# EAGLE schematic rxsms-2.0 (EAGLE 6.6.0)

## Sheet 1 of 8
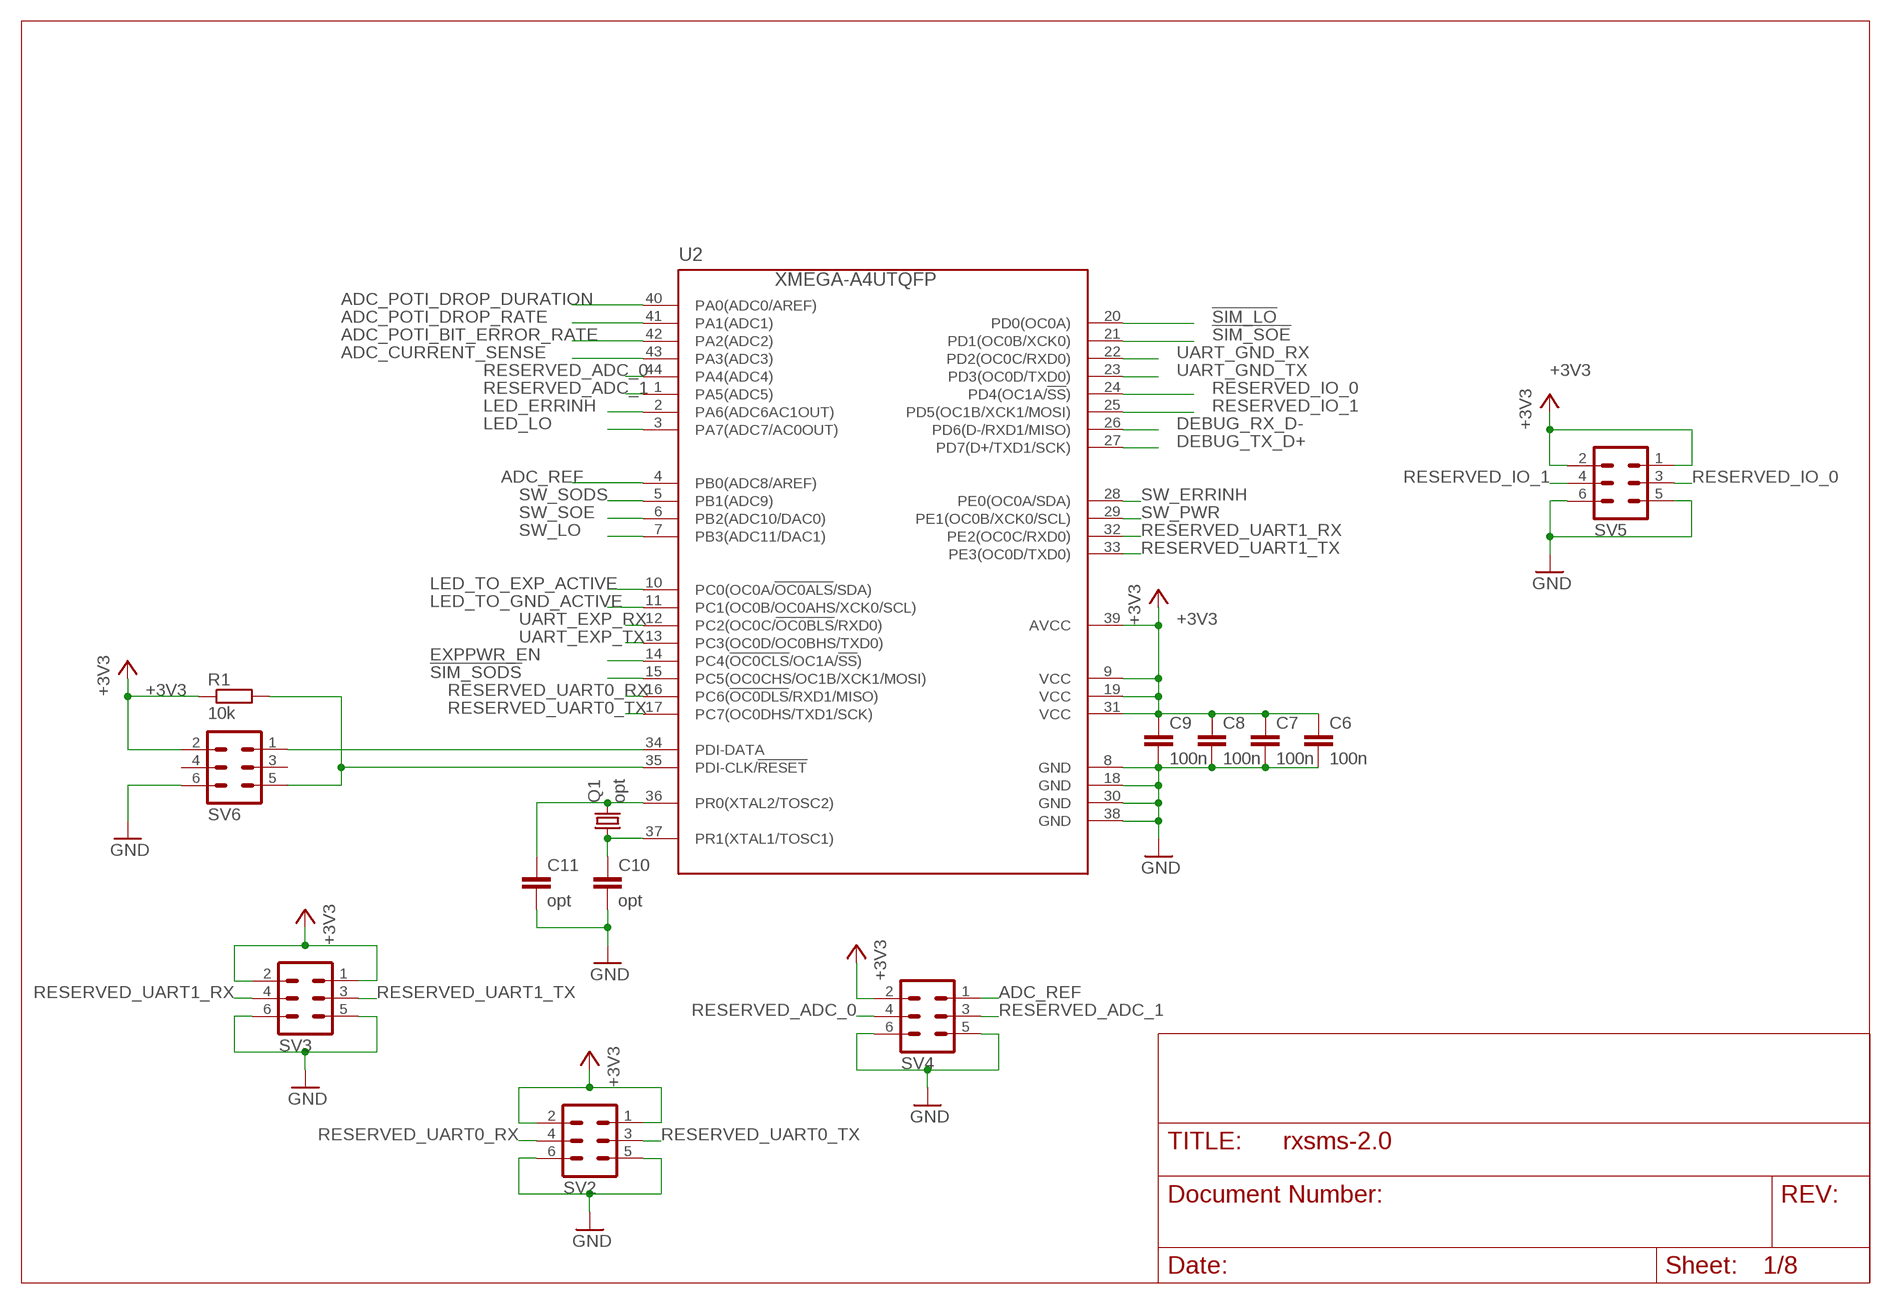
[diagram p0: schematic, sheet 1]

### Parts
C6  100n  C-EUC0805K  [C0805K]
C7  100n  C-EUC0805K  [C0805K]
C8  100n  C-EUC0805K  [C0805K]
C9  100n  C-EUC0805K  [C0805K]
C10  opt  C-EUC0805K  [C0805K]
C11  opt  C-EUC0805K  [C0805K]
Q1  opt  CRYSTALHC49S  [HC49/S]
R1  10k  R-EU_R0805  [R0805]
SV2  ML6  [ML6]
SV3  ML6  [ML6]
SV4  ML6  [ML6]
SV5  ML6  [ML6]
SV6  ML6  [ML6]
U2  XMEGA-A4UTQFP  [TQFP44]

### Nets
!SIM_LO: U2.20(PD0(OC0A)) ; also sheet 4,8
!SIM_SODS: U2.15(PC5(OC0CHS/OC1B/XCK1/MOSI)) ; also sheet 4,7
!SIM_SOE: U2.21(PD1(OC0B/XCK0)) ; also sheet 4,7
+3V3: C6.1 C7.1 C8.1 C9.1 R1.1 SV2.1 SV2.2 SV3.1 SV3.2 SV4.2 SV5.1 SV5.2 SV6.2 U2.9(VCC) U2.19(VCC) U2.31(VCC) U2.39(AVCC) ; also sheet 2,3,4,5,7
ADC_CURRENT_SENSE: U2.43(PA3(ADC3)) ; also sheet 4
ADC_POTI_BIT_ERROR_RATE: U2.42(PA2(ADC2)) ; also sheet 6
ADC_POTI_DROP_DURATION: U2.40(PA0(ADC0/AREF)) ; also sheet 6
ADC_POTI_DROP_RATE: U2.41(PA1(ADC1)) ; also sheet 6
ADC_REF: SV4.1 U2.4(PB0(ADC8/AREF)) ; also sheet 6
DEBUG_RX_D-: U2.26(PD6(D-/RXD1/MISO)) ; also sheet 2,5
DEBUG_TX_D+: U2.27(PD7(D+/TXD1/SCK)) ; also sheet 2,5
EXPPWR_EN: U2.14(PC4(!OC0CLS!/OC1A/!SS!)) ; also sheet 4,7
GND: C6.2 C7.2 C8.2 C9.2 C10.2 C11.2 SV2.5 SV2.6 SV3.5 SV3.6 SV4.5 SV4.6 SV5.5 SV5.6 SV6.6 U2.8(GND) U2.18(GND) U2.30(GND) U2.38(GND) ; also sheet 2,3,4,5,6,7,8
LED_ERRINH: U2.2(PA6(ADC6AC1OUT)) ; also sheet 7
LED_LO: U2.3(PA7(ADC7/AC0OUT)) ; also sheet 7
LED_TO_EXP_ACTIVE: U2.10(PC0(OC0A/!OC0ALS!/SDA)) ; also sheet 7
LED_TO_GND_ACTIVE: U2.11(PC1(OC0B/OC0AHS/XCK0/SCL)) ; also sheet 7
N$11: C10.1 Q1.1 U2.37(PR1(XTAL1/TOSC1))
N$12: C11.1 Q1.2 U2.36(PR0(XTAL2/TOSC2))
N$13: SV6.1 U2.34(PDI-DATA)
N$14: R1.2 SV6.5 U2.35(PDI-CLK/!RESET)
RESERVED_ADC_0: SV4.4 U2.44(PA4(ADC4))
RESERVED_ADC_1: SV4.3 U2.1(PA5(ADC5))
RESERVED_IO_0: SV5.3 U2.24(PD4(OC1A/!SS!))
RESERVED_IO_1: SV5.4 U2.25(PD5(OC1B/XCK1/MOSI))
RESERVED_UART0_RX: SV2.4 U2.16(PC6(!OC0DLS!/RXD1/MISO))
RESERVED_UART0_TX: SV2.3 U2.17(PC7(OC0DHS/TXD1/SCK))
RESERVED_UART1_RX: SV3.4 U2.32(PE2(OC0C/RXD0))
RESERVED_UART1_TX: SV3.3 U2.33(PE3(OC0D/TXD0))
SW_ERRINH: U2.28(PE0(OC0A/SDA)) ; also sheet 7
SW_LO: U2.7(PB3(ADC11/DAC1)) ; also sheet 7
SW_PWR: U2.29(PE1(OC0B/XCK0/SCL)) ; also sheet 7
SW_SODS: U2.5(PB1(ADC9)) ; also sheet 7
SW_SOE: U2.6(PB2(ADC10/DAC0)) ; also sheet 7
UART_EXP_RX: U2.12(PC2(OC0C/!OC0BLS!/RXD0)) ; also sheet 2,4
UART_EXP_TX: U2.13(PC3(OC0D/OC0BHS/TXD0)) ; also sheet 2,4
UART_GND_RX: U2.22(PD2(OC0C/RXD0)) ; also sheet 2
UART_GND_TX: U2.23(PD3(OC0D/TXD0)) ; also sheet 2
Unconnected: SV6.3 SV6.4

## Sheet 2 of 8
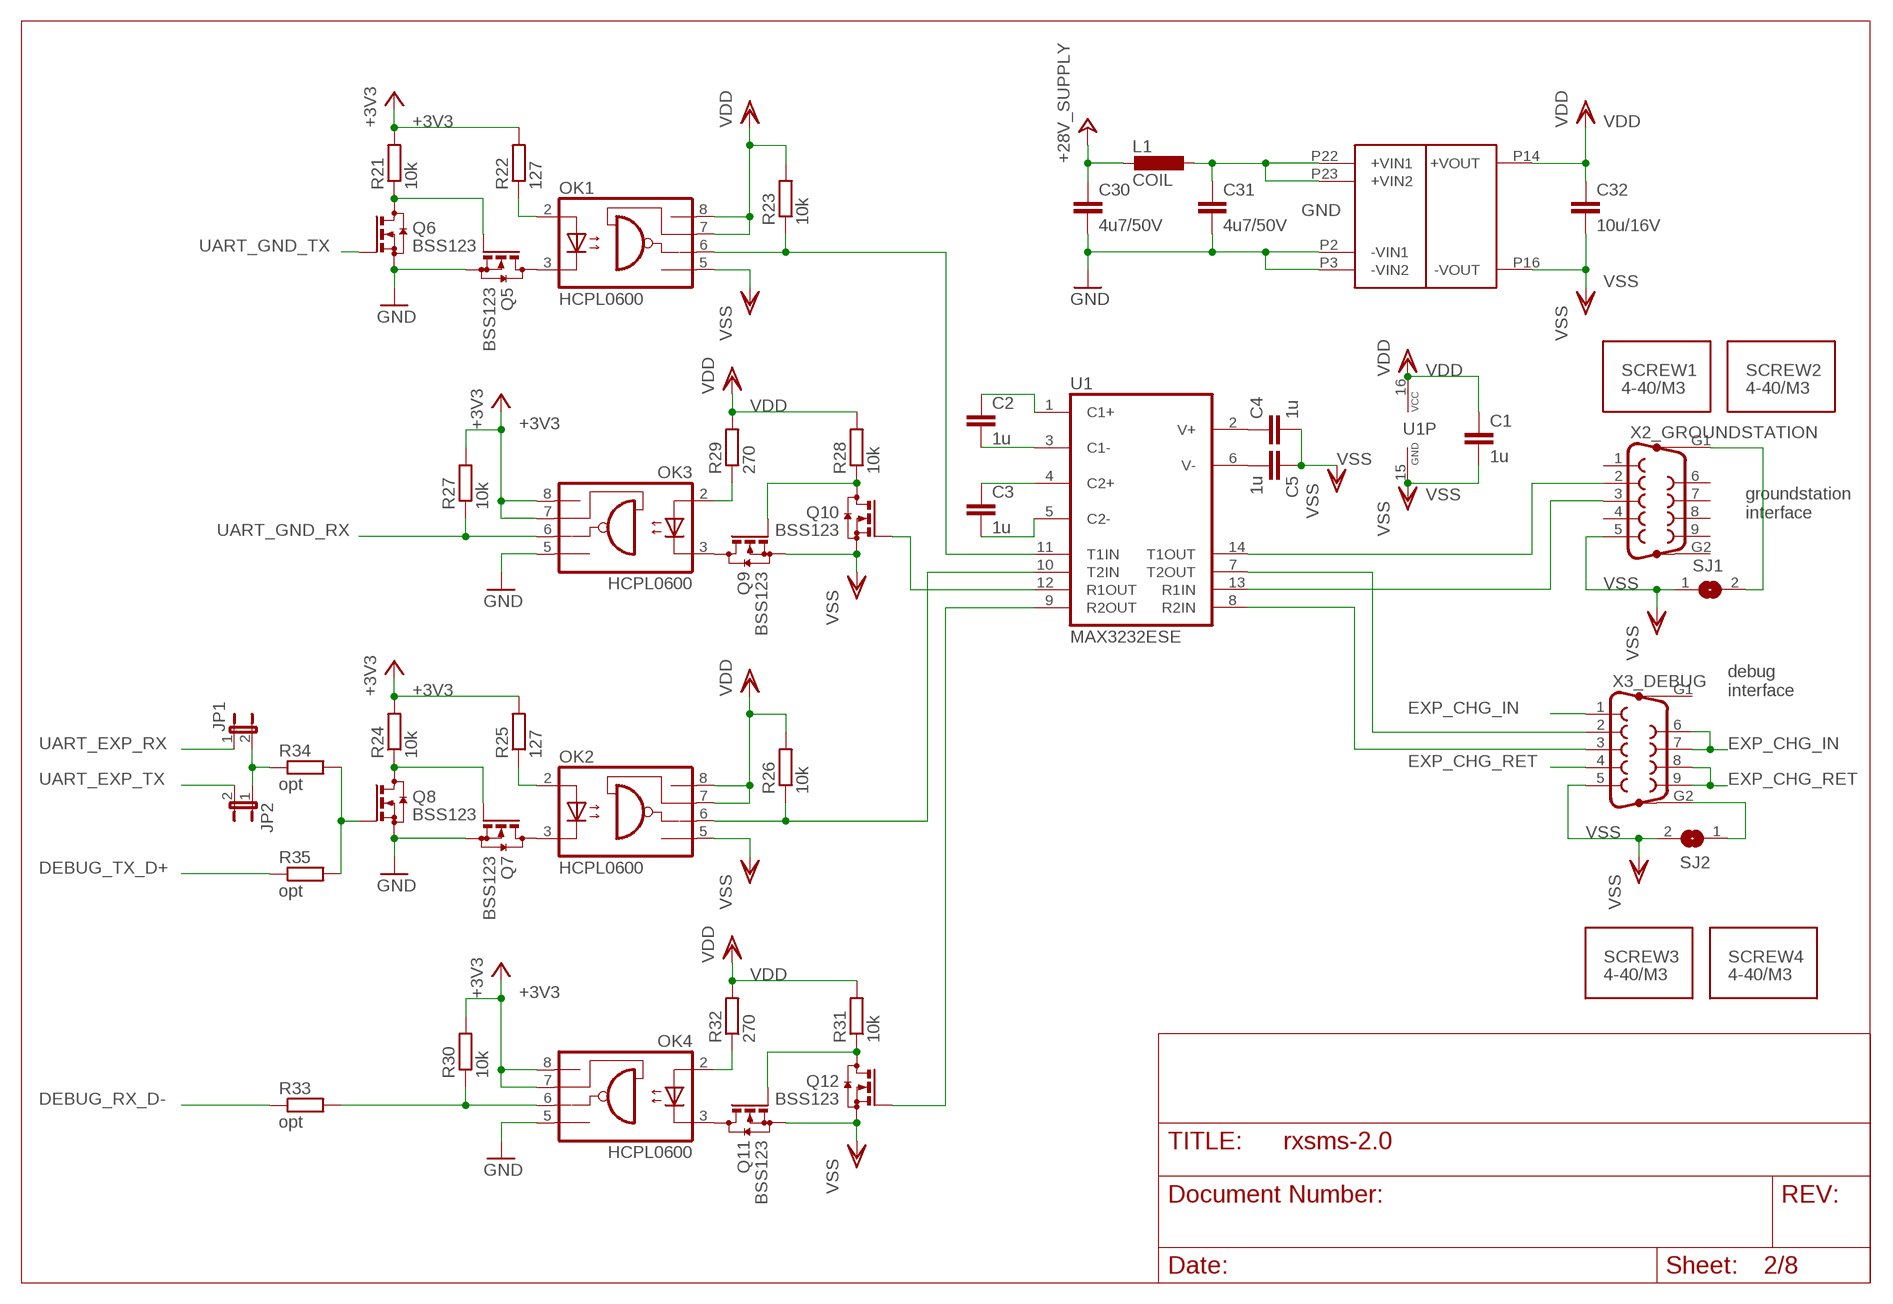
[diagram p1: schematic, sheet 2]

### Parts
C1  1u  C-EUC0805K  [C0805K]
C2  1u  C-EUC0805K  [C0805K]
C3  1u  C-EUC0805K  [C0805K]
C4  1u  C-EUC0805K  [C0805K]
C5  1u  C-EUC0805K  [C0805K]
C30  4u7/50V  C-EUC0805K  [C0805K]
C31  4u7/50V  C-EUC0805K  [C0805K]
C32  10u/16V  C-EUC0805K  [C0805K]
JP1  JP1E  [JP1]
JP2  JP1E  [JP1]
L1  COIL  [BOURNS-SRR0906]
OK1  HCPL0600  [SOIC08]
OK2  HCPL0600  [SOIC08]
OK3  HCPL0600  [SOIC08]
OK4  HCPL0600  [SOIC08]
Q5  BSS123  [SOT23]
Q6  BSS123  [SOT23]
Q7  BSS123  [SOT23]
Q8  BSS123  [SOT23]
Q9  BSS123  [SOT23]
Q10  BSS123  [SOT23]
Q11  BSS123  [SOT23]
Q12  BSS123  [SOT23]
R21  10k  R-EU_R0805  [R0805]
R22  127  R-EU_R0805  [R0805]
R23  10k  R-EU_R0805  [R0805]
R24  10k  R-EU_R0805  [R0805]
R25  127  R-EU_R0805  [R0805]
R26  10k  R-EU_R0805  [R0805]
R27  10k  R-EU_R0805  [R0805]
R28  10k  R-EU_R0805  [R0805]
R29  270  R-EU_R0805  [R0805]
R30  10k  R-EU_R0805  [R0805]
R31  10k  R-EU_R0805  [R0805]
R32  270  R-EU_R0805  [R0805]
R33  opt  R-EU_R0805  [R0805]
R34  opt  R-EU_R0805  [R0805]
R35  opt  R-EU_R0805  [R0805]
SCREW1  4-40/M3  DSUB_MOUNTING_SCREW  [SCREW_DUMMY]
SCREW2  4-40/M3  DSUB_MOUNTING_SCREW  [SCREW_DUMMY]
SCREW3  4-40/M3  DSUB_MOUNTING_SCREW  [SCREW_DUMMY]
SCREW4  4-40/M3  DSUB_MOUNTING_SCREW  [SCREW_DUMMY]
SJ1  SJ  [SJ]
SJ2  SJ  [SJ]
U1  MAX3232ESE  [SO16]
U$10  TEN3-2410N  [TEN3-2410N]
X2_GROUNDSTATION  F09HP  [F09HP]
X3_DEBUG  F09HP  [F09HP]

### Nets
+3V3: OK3.7(VE) OK3.8(VCC) OK4.7(VE) OK4.8(VCC) R21.2 R22.2 R24.2 R25.2 R27.2 R30.2 ; also sheet 1,3,4,5,7
+28V_SUPPLY: C30.1 L1.P4 ; also sheet 3,4,8
DEBUG_RX_D-: R33.1 ; also sheet 1,5
DEBUG_TX_D+: R35.1 ; also sheet 1,5
EXP_CHG_IN: X3_DEBUG.1 X3_DEBUG.6 X3_DEBUG.7 ; also sheet 4
EXP_CHG_RET: X3_DEBUG.4 X3_DEBUG.8 X3_DEBUG.9 ; also sheet 4
GND: C30.2 C31.2 OK3.5(GND) OK4.5(GND) Q5.2(S) Q6.2(S) Q7.2(S) Q8.2(S) U$10.P2(-VIN1) U$10.P3(-VIN2) ; also sheet 1,3,4,5,6,7,8
N$1: C4.1 U1.2(V+)
N$2: C5.2 U1.6(V-)
N$3: U1.14(T1OUT) X2_GROUNDSTATION.2
N$4: C2.2 U1.3(C1-)
N$5: C2.1 U1.1(C1+)
N$6: C3.1 U1.4(C2+)
N$7: C3.2 U1.5(C2-)
N$8: U1.13(R1IN) X2_GROUNDSTATION.3
N$9: U1.7(T2OUT) X3_DEBUG.2
N$10: U1.8(R2IN) X3_DEBUG.3
N$38: OK1.3(C) Q5.3(D)
N$39: OK1.6(VO) R23.1 U1.11(T1IN)
N$40: Q5.1(G) Q6.3(D) R21.1
N$41: Q11.1(G) Q12.3(D) R31.1
N$42: OK1.2(A) R22.1
N$43: OK2.3(C) Q7.3(D)
N$44: OK2.2(A) R25.1
N$45: OK2.6(VO) R26.1 U1.10(T2IN)
N$46: Q7.1(G) Q8.3(D) R24.1
N$47: Q9.1(G) Q10.3(D) R28.1
N$48: OK3.3(C) Q9.3(D)
N$49: OK4.3(C) Q11.3(D)
N$50: OK3.2(A) R29.1
N$51: OK4.2(A) R32.1
N$52: Q10.1(G) U1.12(R1OUT)
N$53: Q12.1(G) U1.9(R2OUT)
N$54: OK4.6(VO) R30.1 R33.2
N$55: Q8.1(G) R34.2 R35.2
N$56: SJ1.2 X2_GROUNDSTATION.G1
N$57: SJ2.1 X3_DEBUG.G2
N$59: JP1.2 JP2.1 R34.1
N$70: C31.1 L1.P1 U$10.P22(+VIN1) U$10.P23(+VIN2)
UART_EXP_RX: JP1.1 ; also sheet 1,4
UART_EXP_TX: JP2.2 ; also sheet 1,4
UART_GND_RX: OK3.6(VO) R27.1 ; also sheet 1
UART_GND_TX: Q6.1(G) ; also sheet 1
VDD: C1.1 C32.1 OK1.7(VE) OK1.8(VCC) OK2.7(VE) OK2.8(VCC) R23.2 R26.2 R28.2 R29.2 R31.2 R32.2 U1.16(VCC) U$10.P14(+VOUT)
VSS: C1.2 C4.2 C5.1 C32.2 OK1.5(GND) OK2.5(GND) Q9.2(S) Q10.2(S) Q11.2(S) Q12.2(S) SJ1.1 SJ2.2 U1.15(GND) U$10.P16(-VOUT) X2_GROUNDSTATION.5 X3_DEBUG.5
Unconnected: X2_GROUNDSTATION.1 X2_GROUNDSTATION.4 X2_GROUNDSTATION.6 X2_GROUNDSTATION.7 X2_GROUNDSTATION.8 X2_GROUNDSTATION.9 X2_GROUNDSTATION.G2 X3_DEBUG.G1

### Notes on the sheet
- groundstation
  interface
- debug
  interface

## Sheet 3 of 8
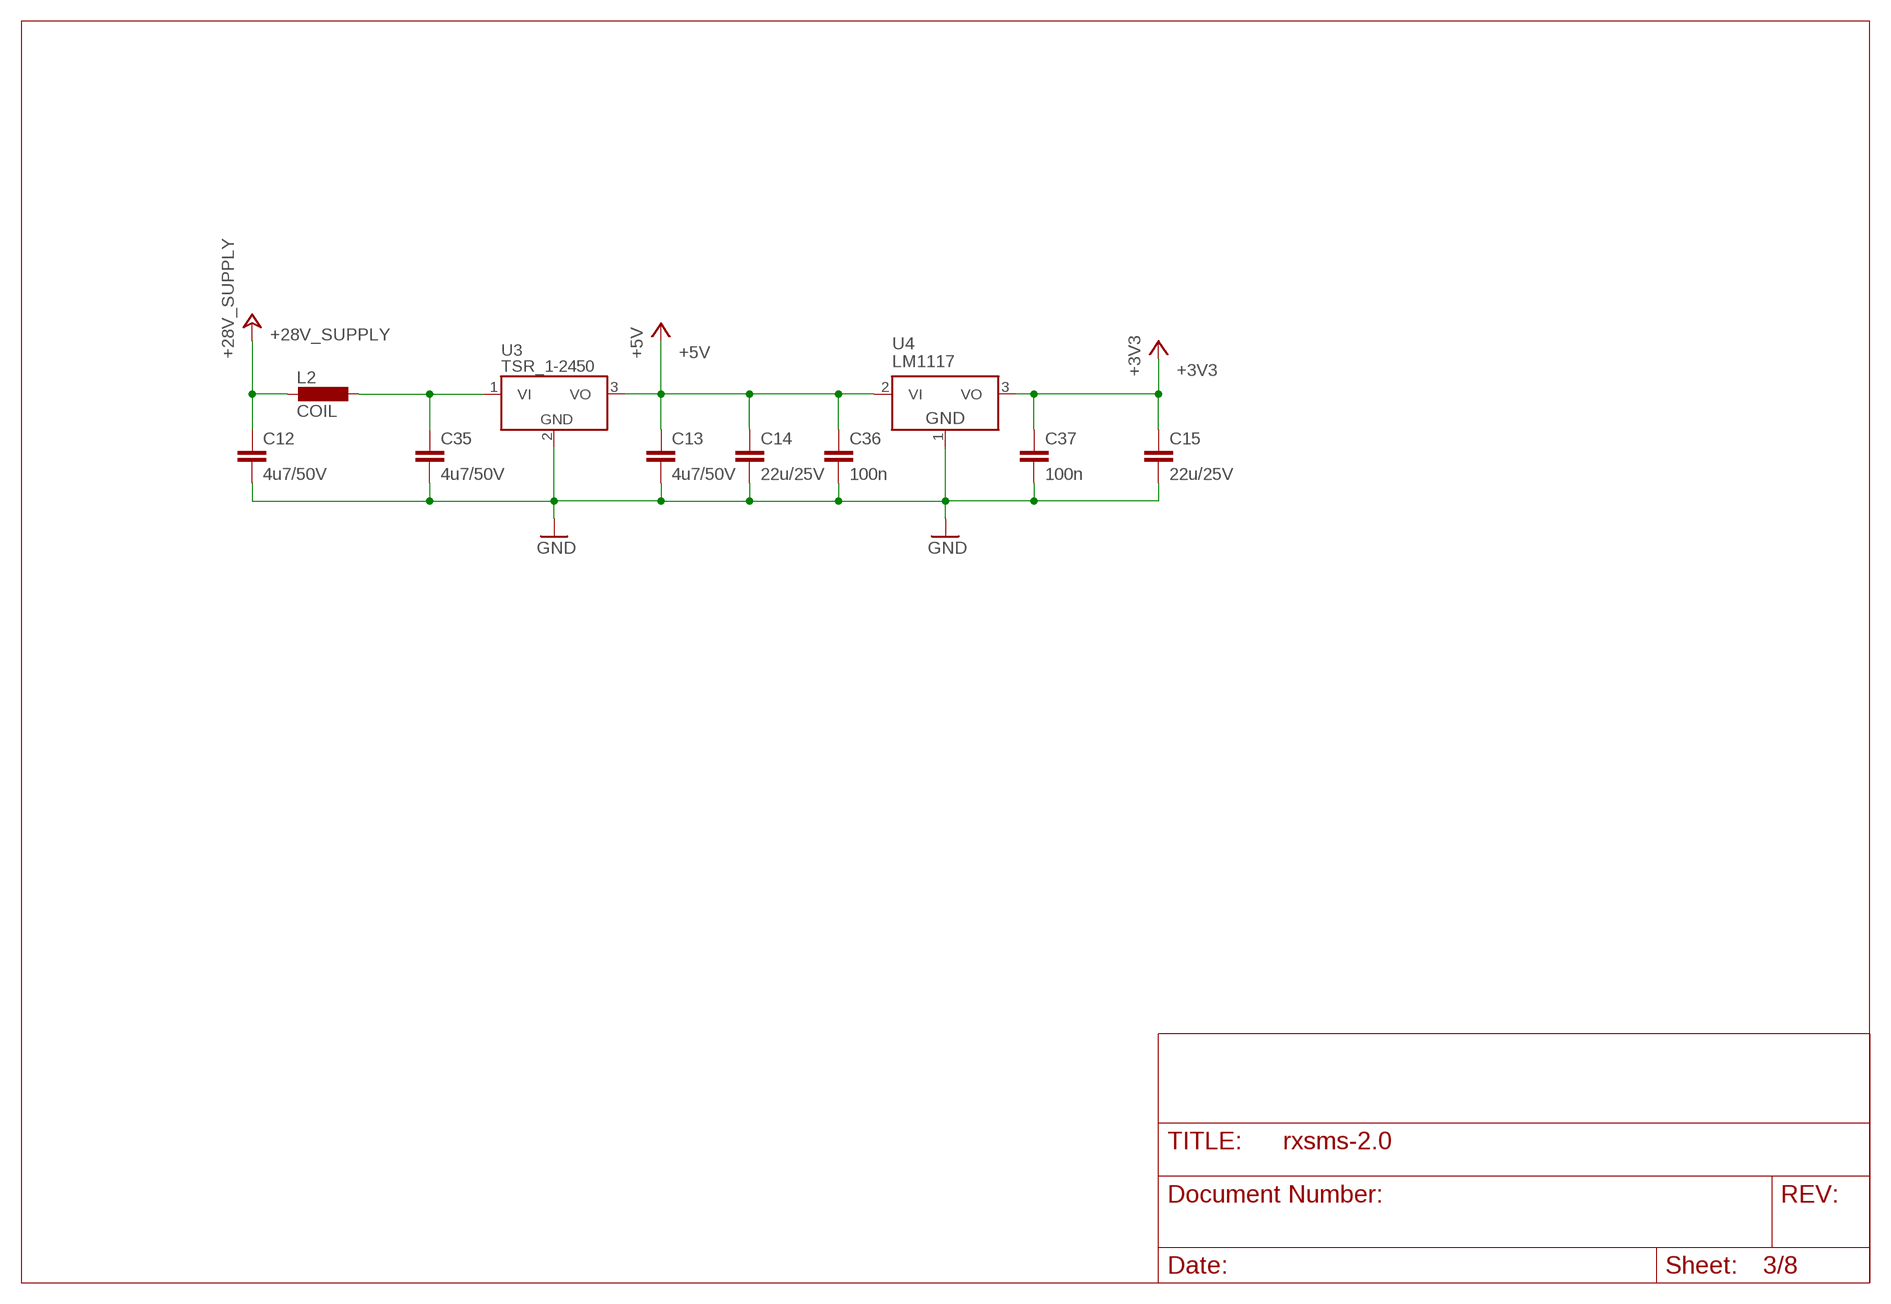
[diagram p2: schematic, sheet 3]

### Parts
C12  4u7/50V  C-EUC0805K  [C0805K]
C13  4u7/50V  C-EUC0805K  [C0805K]
C14  22u/25V  C-EUC0805K  [C0805K]
C15  22u/25V  C-EUC0805K  [C0805K]
C35  4u7/50V  C-EUC0805K  [C0805K]
C36  100n  C-EUC0805K  [C0805K]
C37  100n  C-EUC0805K  [C0805K]
L2  COIL  [BOURNS-SRR0906]
U3  TSR_1-2450  [TSR-1]
U4  LM1117  [TO252]

### Nets
+3V3: C15.1 C37.1 U4.3(VO) ; also sheet 1,2,4,5,7
+5V: C13.1 C14.1 C36.1 U3.3(VO) U4.2(VI) ; also sheet 4,6,7
+28V_SUPPLY: C12.1 L2.P4 ; also sheet 2,4,8
GND: C12.2 C13.2 C14.2 C15.2 C35.2 C36.2 C37.2 U3.2(GND) U4.1(GND) ; also sheet 1,2,4,5,6,7,8
VI: C35.1 L2.P1 U3.1(VI)

## Sheet 4 of 8
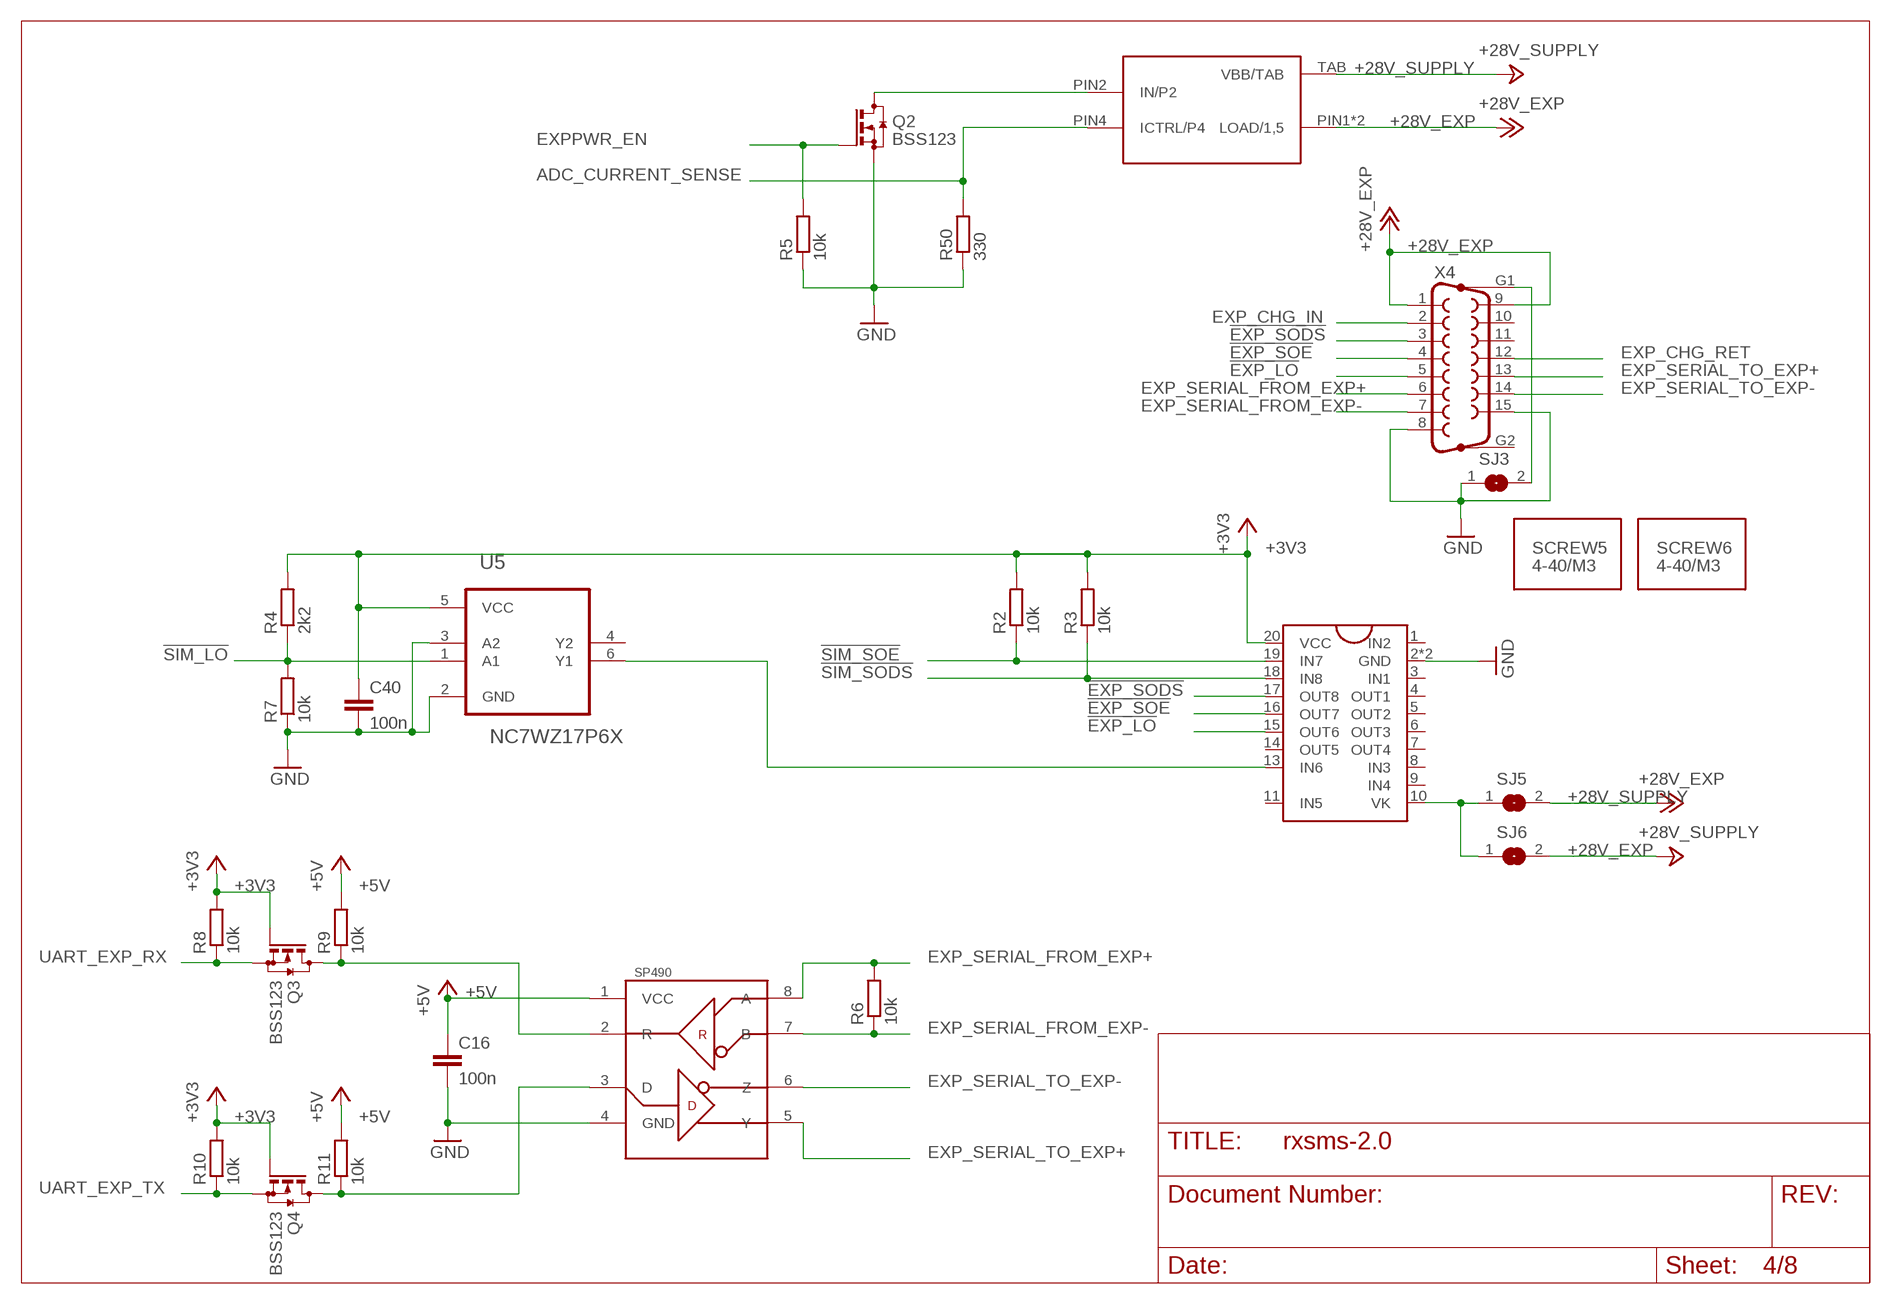
[diagram p3: schematic, sheet 4]

### Parts
C16  100n  C-EUC0805K  [C0805K]
C40  100n  C-EUC0805K  [C0805K]
Q2  BSS123  [SOT23]
Q3  BSS123  [SOT23]
Q4  BSS123  [SOT23]
R2  10k  R-EU_R0805  [R0805]
R3  10k  R-EU_R0805  [R0805]
R4  2k2  R-EU_R0805  [R0805]
R5  10k  R-EU_R0805  [R0805]
R6  10k  R-EU_R0805  [R0805]
R7  10k  R-EU_R0805  [R0805]
R8  10k  R-EU_R0805  [R0805]
R9  10k  R-EU_R0805  [R0805]
R10  10k  R-EU_R0805  [R0805]
R11  10k  R-EU_R0805  [R0805]
R50  330  R-EU_R0805  [R0805]
SCREW5  4-40/M3  DSUB_MOUNTING_SCREW  [SCREW_DUMMY]
SCREW6  4-40/M3  DSUB_MOUNTING_SCREW  [SCREW_DUMMY]
SJ3  SJ  [SJ]
SJ5  SJ  [SJ]
SJ6  SJ  [SJ]
U5  NC7WZ17P6X  [SOT65P210X110-6N]
U$4  UDN2596  [DIL20]
U$5  SP490  [SO08]
U$6  BTS6143  [TO-252-5-1]
X4  F15HP  [F15HP]

### Nets
!EXP_LO: U$4.15(OUT6) X4.5 ; also sheet 8
!EXP_SODS: U$4.17(OUT8) X4.3
!EXP_SOE: U$4.16(OUT7) X4.4
!SIM_LO: R4.1 R7.2 U5.1(A1) ; also sheet 1,8
!SIM_SODS: R3.1 U$4.18(IN8) ; also sheet 1,7
!SIM_SOE: R2.1 U$4.19(IN7) ; also sheet 1,7
+3V3: C40.1 Q3.1(G) Q4.1(G) R2.2 R3.2 R4.2 R8.2 R10.2 U5.5(VCC) U$4.20(VCC) ; also sheet 1,2,3,5,7
+5V: C16.1 R9.2 R11.2 U$5.1(VCC) ; also sheet 3,6,7
+28V_EXP: SJ6.2 U$6.PIN1(LOAD/1,5) U$6.PIN5(LOAD/1,5) X4.1 X4.9 ; supply symbol labelled +28V_SUPPLY
+28V_SUPPLY: SJ5.2 U$6.TAB(VBB/TAB) ; supply symbol labelled +28V_EXP ; also sheet 2,3,8
ADC_CURRENT_SENSE: R50.2 U$6.PIN4(ICTRL/P4) ; also sheet 1
EXP_CHG_IN: X4.2 ; also sheet 2
EXP_CHG_RET: X4.12 ; also sheet 2
EXP_SERIAL_FROM_EXP+: R6.2 U$5.8(A) X4.6
EXP_SERIAL_FROM_EXP-: R6.1 U$5.7(B) X4.7
EXP_SERIAL_TO_EXP+: U$5.5(Y) X4.13
EXP_SERIAL_TO_EXP-: U$5.6(Z) X4.14
EXPPWR_EN: Q2.1(G) R5.2 ; also sheet 1,7
GND: C16.2 C40.2 Q2.2(S) R5.1 R7.1 R50.1 SJ3.1 U5.2(GND) U5.3(A2) U$4.2(GND) U$4.12(GND) U$5.4(GND) X4.8 X4.15 ; also sheet 1,2,3,5,6,7,8
N$16: Q2.3(D) U$6.PIN2(IN/P2)
N$20: Q3.3(D) R9.1 U$5.2(R)
N$21: Q4.3(D) R11.1 U$5.3(D)
N$32: SJ5.1 SJ6.1 U$4.10(VK)
N$58: SJ3.2 X4.G1
N$67: U5.6(Y1) U$4.13(IN6)
UART_EXP_RX: Q3.2(S) R8.1 ; also sheet 1,2
UART_EXP_TX: Q4.2(S) R10.1 ; also sheet 1,2
Unconnected: U5.4(Y2) U$4.1(IN2) U$4.3(IN1) U$4.4(OUT1) U$4.5(OUT2) U$4.6(OUT3) U$4.7(OUT4) U$4.8(IN3) U$4.9(IN4) U$4.11(IN5) U$4.14(OUT5) X4.10 X4.11 X4.G2

## Sheet 5 of 8
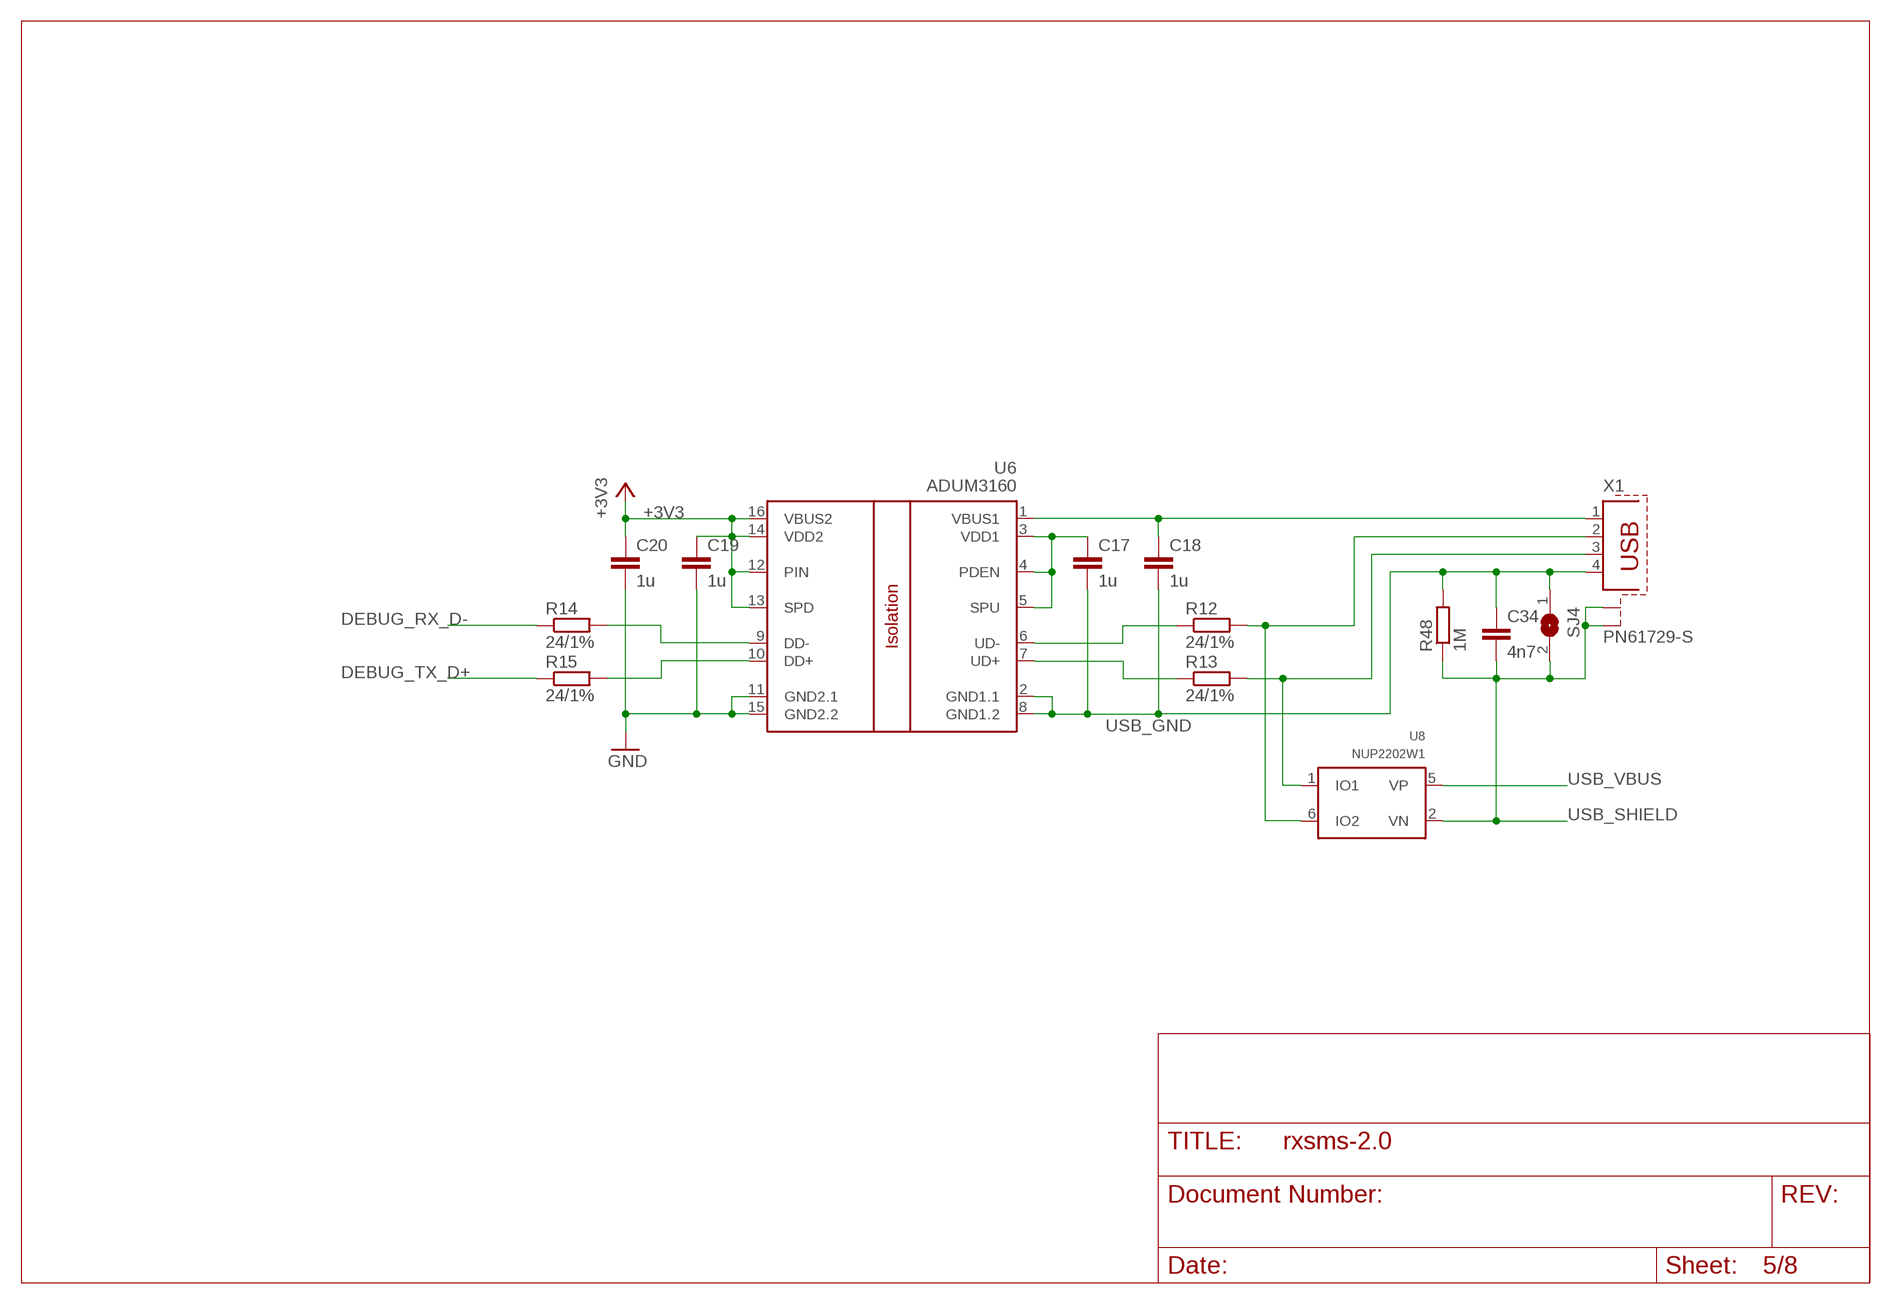
[diagram p4: schematic, sheet 5]

### Parts
C17  1u  C-EUC0805K  [C0805K]
C18  1u  C-EUC0805K  [C0805K]
C19  1u  C-EUC0805K  [C0805K]
C20  1u  C-EUC0805K  [C0805K]
C34  4n7  C-EUC0805K  [C0805K]
R12  24/1%  R-EU_R0805  [R0805]
R13  24/1%  R-EU_R0805  [R0805]
R14  24/1%  R-EU_R0805  [R0805]
R15  24/1%  R-EU_R0805  [R0805]
R48  1M  R-EU_R0805  [R0805]
SJ4  SJ  [SJ]
U6  ADUM3160  [SO-16W]
U8  NUP2202W1  [SOT363_PHILIPS]
X1  PN61729-S  [PN61729-S]

### Nets
+3V3: C19.1 C20.1 U6.12(PIN) U6.13(SPD) U6.14(VDD2) U6.16(VBUS2) ; also sheet 1,2,3,4,7
DEBUG_RX_D-: R14.1 ; also sheet 1,2
DEBUG_TX_D+: R15.1 ; also sheet 1,2
GND: C19.2 C20.2 U6.11(GND2.1) U6.15(GND2.2) ; also sheet 1,2,3,4,6,7,8
N$18: C17.1 U6.3(VDD1) U6.4(PDEN) U6.5(SPU)
N$19: R12.1 U6.6(UD-)
N$22: R13.1 U6.7(UD+)
N$24: R12.2 U8.6(IO2) X1.2
N$29: R14.2 U6.9(DD-)
N$30: R15.2 U6.10(DD+)
N$68: R13.2 U8.1(IO1) X1.3
USB_GND: C17.2 C18.2 C34.1 R48.2 SJ4.1 U6.2(GND1.1) U6.8(GND1.2) X1.4
USB_SHIELD: C34.2 R48.1 SJ4.2 U8.2(VN) X1.S1 X1.S2
USB_VBUS: C18.1 U6.1(VBUS1) U8.5(VP) X1.1

## Sheet 6 of 8
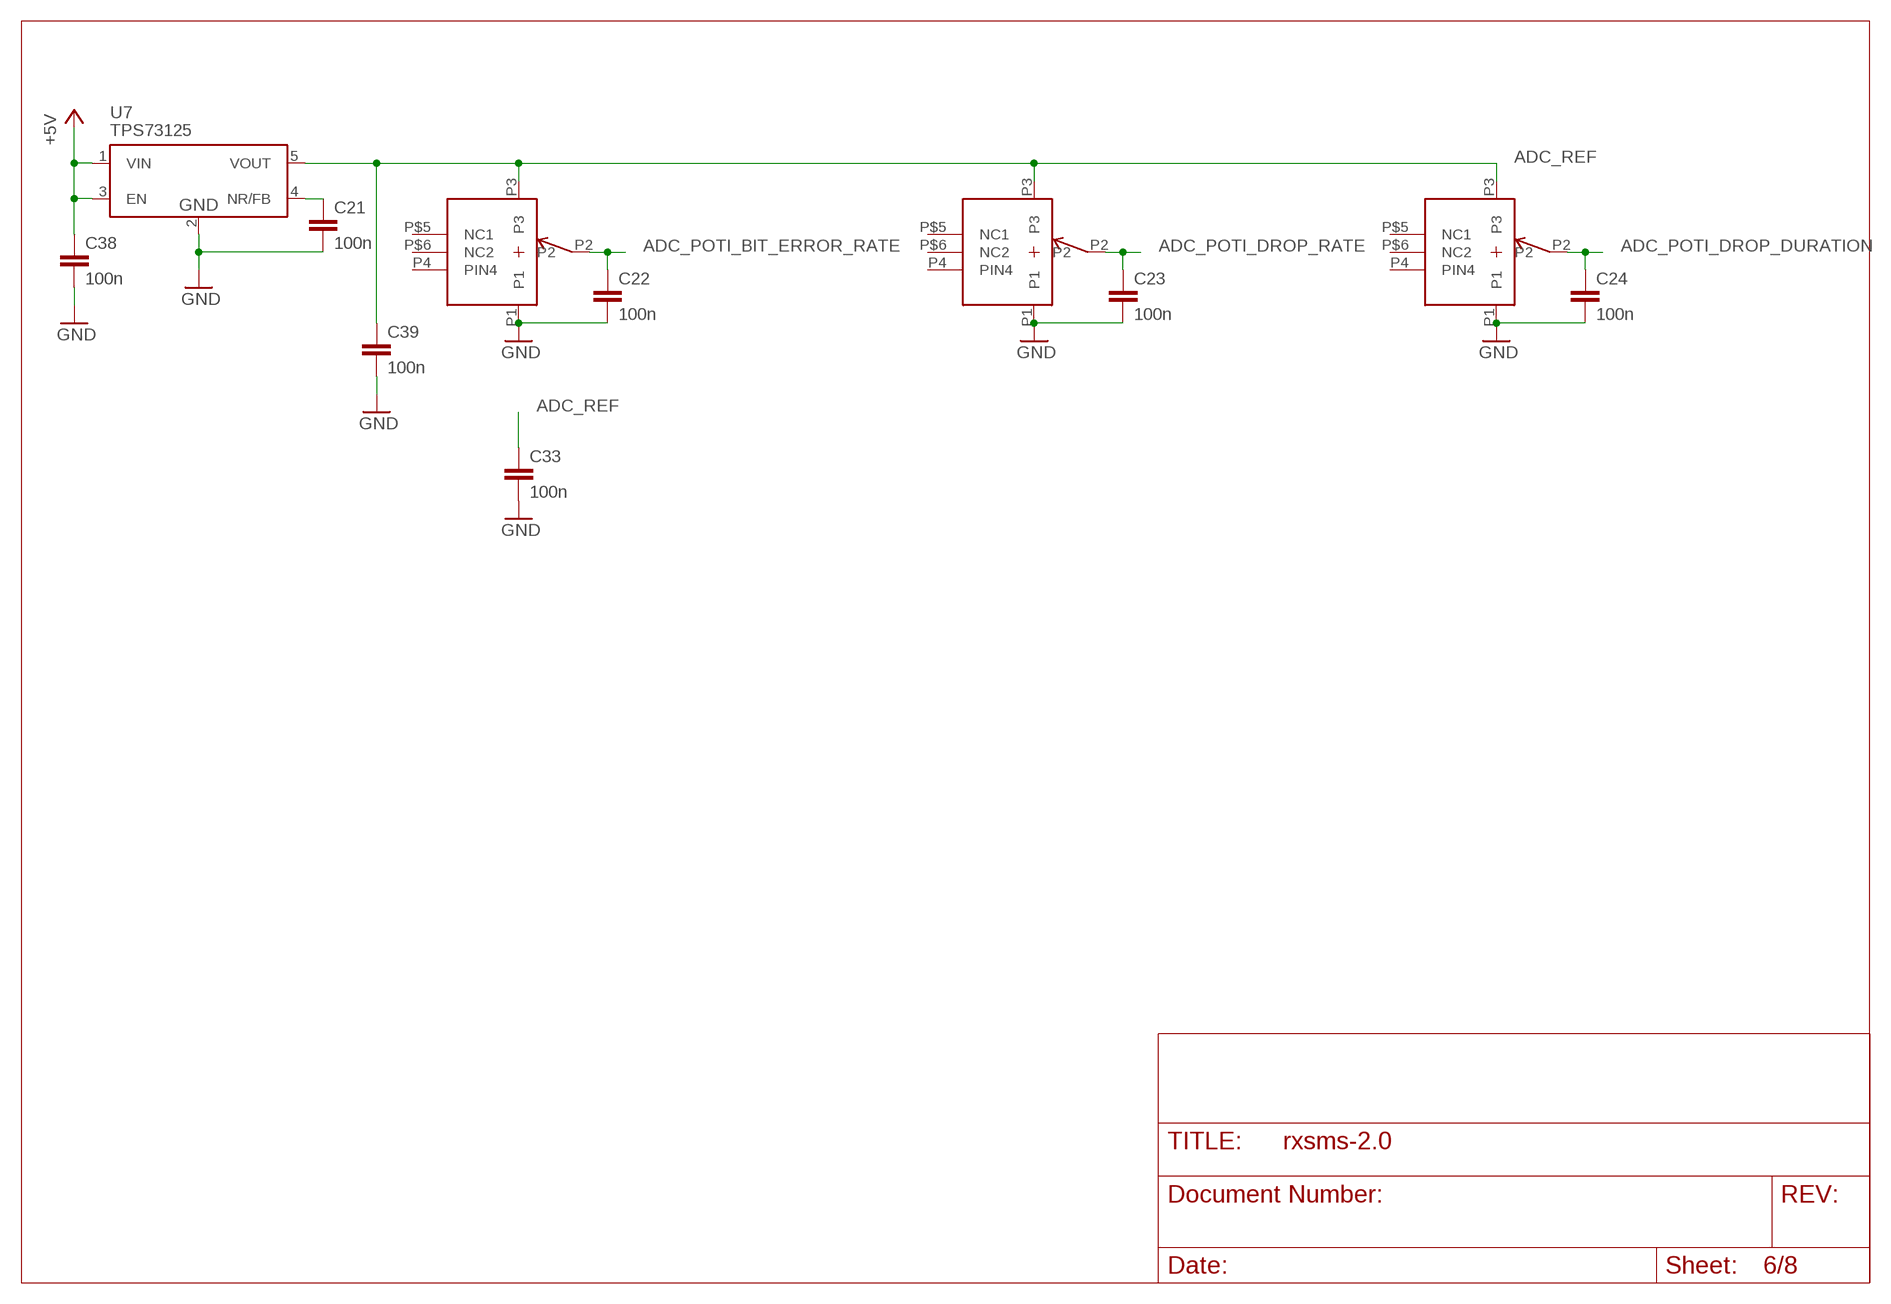
[diagram p5: schematic, sheet 6]

### Parts
C21  100n  C-EUC0805K  [C0805K]
C22  100n  C-EUC0805K  [C0805K]
C23  100n  C-EUC0805K  [C0805K]
C24  100n  C-EUC0805K  [C0805K]
C33  100n  C-EUC0805K  [C0805K]
C38  100n  C-EUC0805K  [C0805K]
C39  100n  C-EUC0805K  [C0805K]
U7  TPS73125  TPS731  [SOT25]
U$7_BER  50k  STRK11K  [VERT_POTI]
U$8_DROPR  50k  STRK11K  [VERT_POTI]
U$9_DROPDUR  50k  STRK11K  [VERT_POTI]

### Nets
+5V: C38.1 U7.1(VIN) U7.3(EN) ; also sheet 3,4,7
ADC_POTI_BIT_ERROR_RATE: C22.1 U$7_BER.P2 ; also sheet 1
ADC_POTI_DROP_DURATION: C24.1 U$9_DROPDUR.P2 ; also sheet 1
ADC_POTI_DROP_RATE: C23.1 U$8_DROPR.P2 ; also sheet 1
ADC_REF: C33.1 C39.1 U7.5(VOUT) U$7_BER.P3 U$8_DROPR.P3 U$9_DROPDUR.P3 ; also sheet 1
GND: C21.2 C22.2 C23.2 C24.2 C33.2 C38.2 C39.2 U7.2(GND) U$7_BER.P1 U$8_DROPR.P1 U$9_DROPDUR.P1 ; also sheet 1,2,3,4,5,7,8
N$25: C21.1 U7.4(NR/FB)
Unconnected: U$7_BER.P4(PIN4) U$7_BER.P$5(NC1) U$7_BER.P$6(NC2) U$8_DROPR.P4(PIN4) U$8_DROPR.P$5(NC1) U$8_DROPR.P$6(NC2) U$9_DROPDUR.P4(PIN4) U$9_DROPDUR.P$5(NC1) U$9_DROPDUR.P$6(NC2)

## Sheet 7 of 8
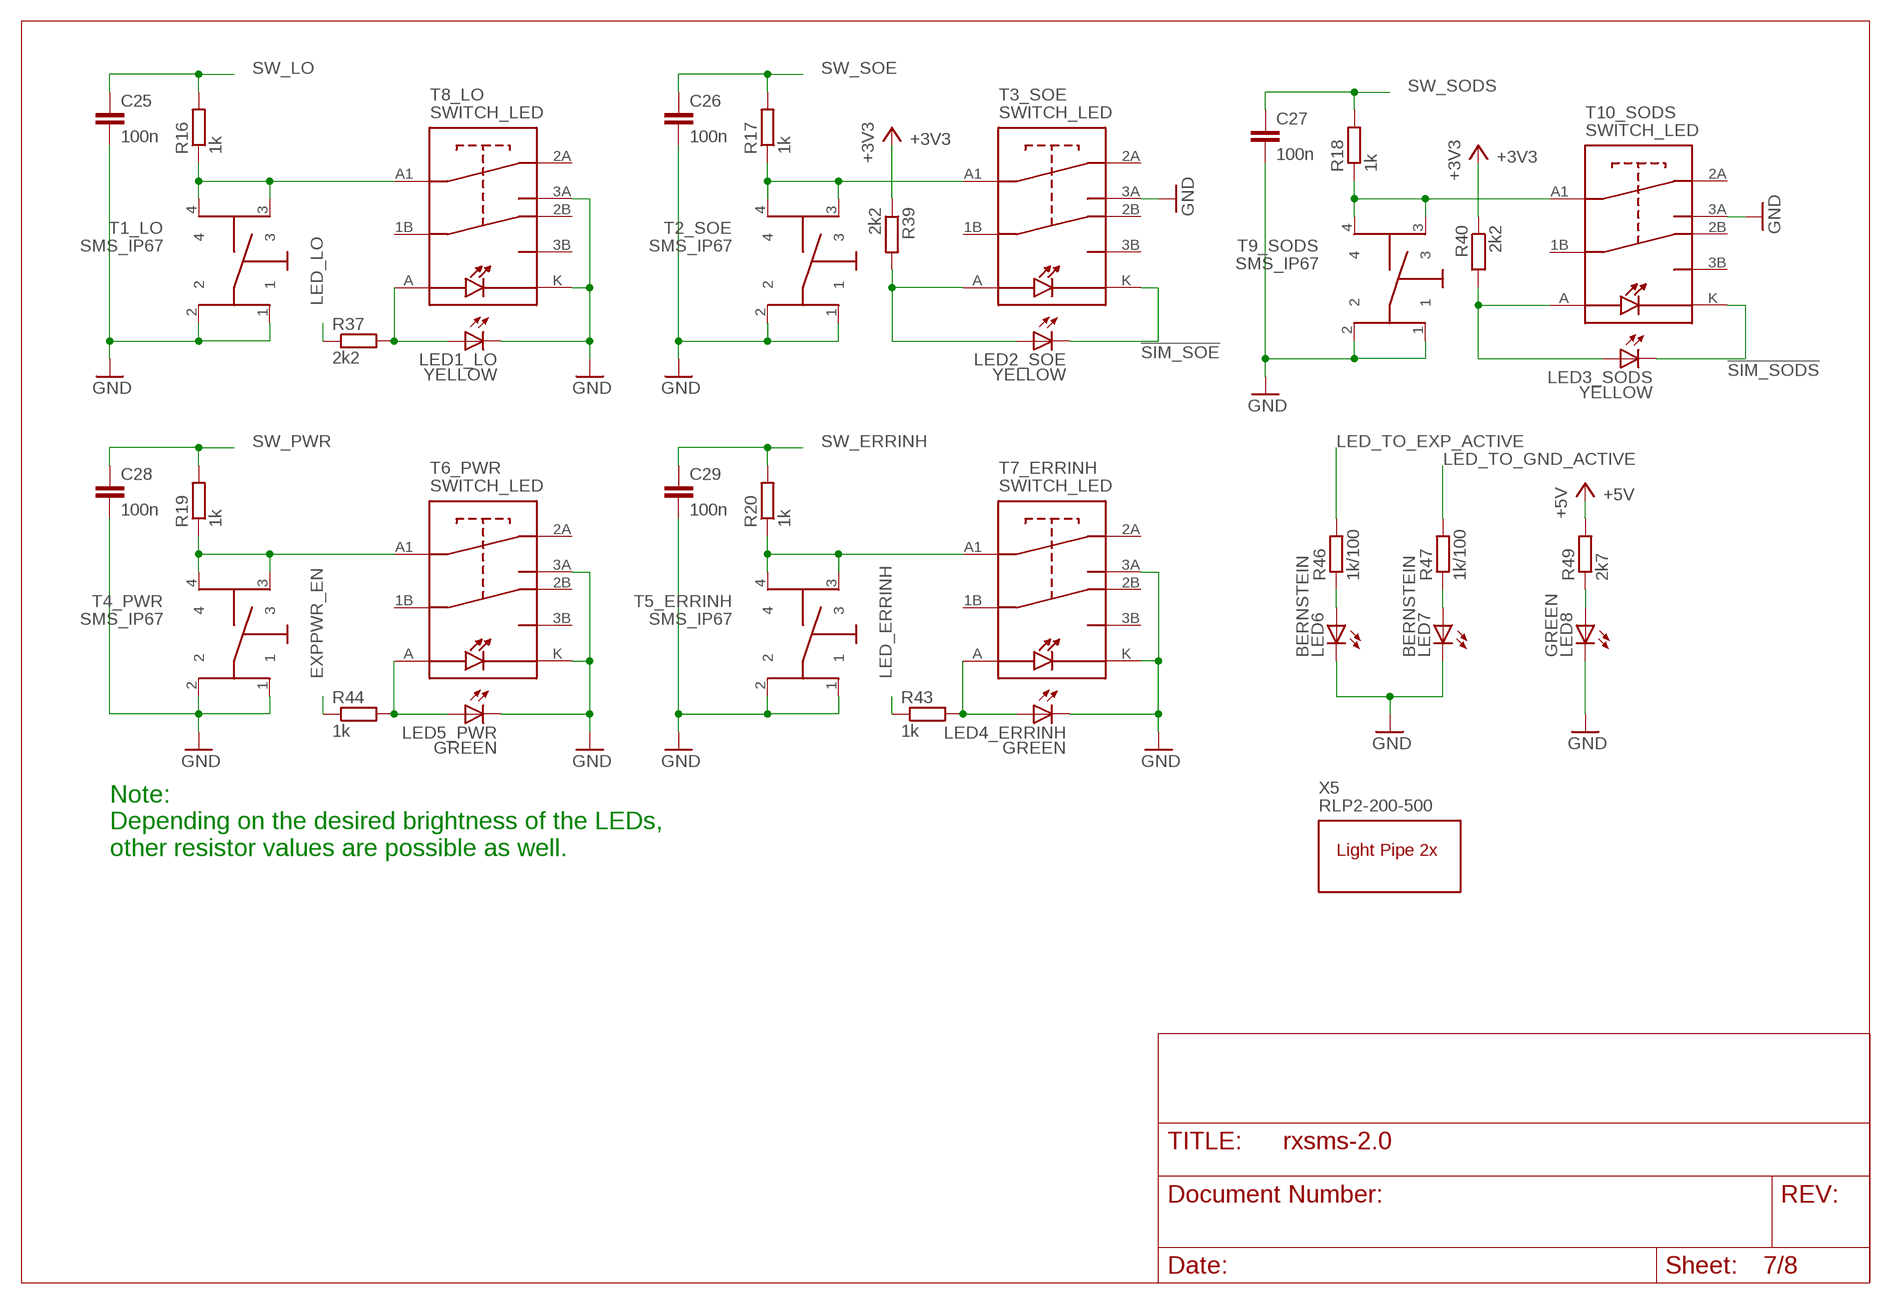
[diagram p6: schematic, sheet 7]

### Parts
C25  100n  C-EUC0805K  [C0805K]
C26  100n  C-EUC0805K  [C0805K]
C27  100n  C-EUC0805K  [C0805K]
C28  100n  C-EUC0805K  [C0805K]
C29  100n  C-EUC0805K  [C0805K]
LED1_LO  YELLOW  LEDCHIPLED_1206  [CHIPLED_1206]
LED2_SOE  YELLOW  LEDCHIPLED_1206  [CHIPLED_1206]
LED3_SODS  YELLOW  LEDCHIPLED_1206  [CHIPLED_1206]
LED4_ERRINH  GREEN  LEDCHIPLED_1206  [CHIPLED_1206]
LED5_PWR  GREEN  LEDCHIPLED_1206  [CHIPLED_1206]
LED6  BERNSTEIN  LEDCHIPLED_1206  [CHIPLED_1206]
LED7  BERNSTEIN  LEDCHIPLED_1206  [CHIPLED_1206]
LED8  GREEN  LEDCHIPLED_1206  [CHIPLED_1206]
R16  1k  R-EU_R0805  [R0805]
R17  1k  R-EU_R0805  [R0805]
R18  1k  R-EU_R0805  [R0805]
R19  1k  R-EU_R0805  [R0805]
R20  1k  R-EU_R0805  [R0805]
R37  2k2  R-EU_R0805  [R0805]
R39  2k2  R-EU_R0805  [R0805]
R40  2k2  R-EU_R0805  [R0805]
R43  1k  R-EU_R0805  [R0805]
R44  1k  R-EU_R0805  [R0805]
R46  1k/100  R-EU_R0805  [R0805]
R47  1k/100  R-EU_R0805  [R0805]
R49  2k7  R-EU_R0805  [R0805]
T1_LO  SMS_IP67  [IP67]
T2_SOE  SMS_IP67  [IP67]
T3_SOE  SWITCH_LED  [SWITCH_LED]
T4_PWR  SMS_IP67  [IP67]
T5_ERRINH  SMS_IP67  [IP67]
T6_PWR  SWITCH_LED  [SWITCH_LED]
T7_ERRINH  SWITCH_LED  [SWITCH_LED]
T8_LO  SWITCH_LED  [SWITCH_LED]
T9_SODS  SMS_IP67  [IP67]
T10_SODS  SWITCH_LED  [SWITCH_LED]
X5  RLP2-200-500  [RLP2-200-500]

### Nets
!SIM_SODS: LED3_SODS.C T10_SODS.K ; also sheet 1,4
!SIM_SOE: LED2_SOE.C T3_SOE.K ; also sheet 1,4
+3V3: R39.1 R40.1 ; also sheet 1,2,3,4,5
+5V: R49.2 ; also sheet 3,4,6
EXPPWR_EN: R44.1 ; also sheet 1,4
GND: C25.2 C26.2 C27.2 C28.2 C29.2 LED1_LO.C LED4_ERRINH.C LED5_PWR.C LED6.C LED7.C LED8.C T1_LO.1 T1_LO.2 T2_SOE.1 T2_SOE.2 T3_SOE.3A T4_PWR.1 T4_PWR.2 T5_ERRINH.1 T5_ERRINH.2 T6_PWR.3A T6_PWR.K T7_ERRINH.3A T7_ERRINH.K T8_LO.3A T8_LO.K T9_SODS.1 T9_SODS.2 T10_SODS.3A ; also sheet 1,2,3,4,5,6,8
LED_ERRINH: R43.1 ; also sheet 1
LED_LO: R37.1 ; also sheet 1
LED_TO_EXP_ACTIVE: R46.2 ; also sheet 1
LED_TO_GND_ACTIVE: R47.2 ; also sheet 1
N$15: LED2_SOE.A R39.2 T3_SOE.A
N$17: LED3_SODS.A R40.2 T10_SODS.A
N$23: LED8.A R49.1
N$26: R16.1 T1_LO.3 T1_LO.4 T8_LO.A1(1A)
N$27: R17.1 T2_SOE.3 T2_SOE.4 T3_SOE.A1(1A)
N$28: R18.1 T9_SODS.3 T9_SODS.4 T10_SODS.A1(1A)
N$31: LED1_LO.A R37.2 T8_LO.A
N$35: R19.1 T4_PWR.3 T4_PWR.4 T6_PWR.A1(1A)
N$37: R20.1 T5_ERRINH.3 T5_ERRINH.4 T7_ERRINH.A1(1A)
N$61: LED4_ERRINH.A R43.2 T7_ERRINH.A
N$63: LED5_PWR.A R44.2 T6_PWR.A
N$65: LED6.A R46.1
N$66: LED7.A R47.1
SW_ERRINH: C29.1 R20.2 ; also sheet 1
SW_LO: C25.1 R16.2 ; also sheet 1
SW_PWR: C28.1 R19.2 ; also sheet 1
SW_SODS: C27.1 R18.2 ; also sheet 1
SW_SOE: C26.1 R17.2 ; also sheet 1
Unconnected: T3_SOE.1B T3_SOE.2A T3_SOE.2B T3_SOE.3B T6_PWR.1B T6_PWR.2A T6_PWR.2B T6_PWR.3B T7_ERRINH.1B T7_ERRINH.2A T7_ERRINH.2B T7_ERRINH.3B T8_LO.1B T8_LO.2A T8_LO.2B T8_LO.3B T10_SODS.1B T10_SODS.2A T10_SODS.2B T10_SODS.3B

### Notes on the sheet
- Note:
  Depending on the desired brightness of the LEDs,
  other resistor values are possible as well.

## Sheet 8 of 8
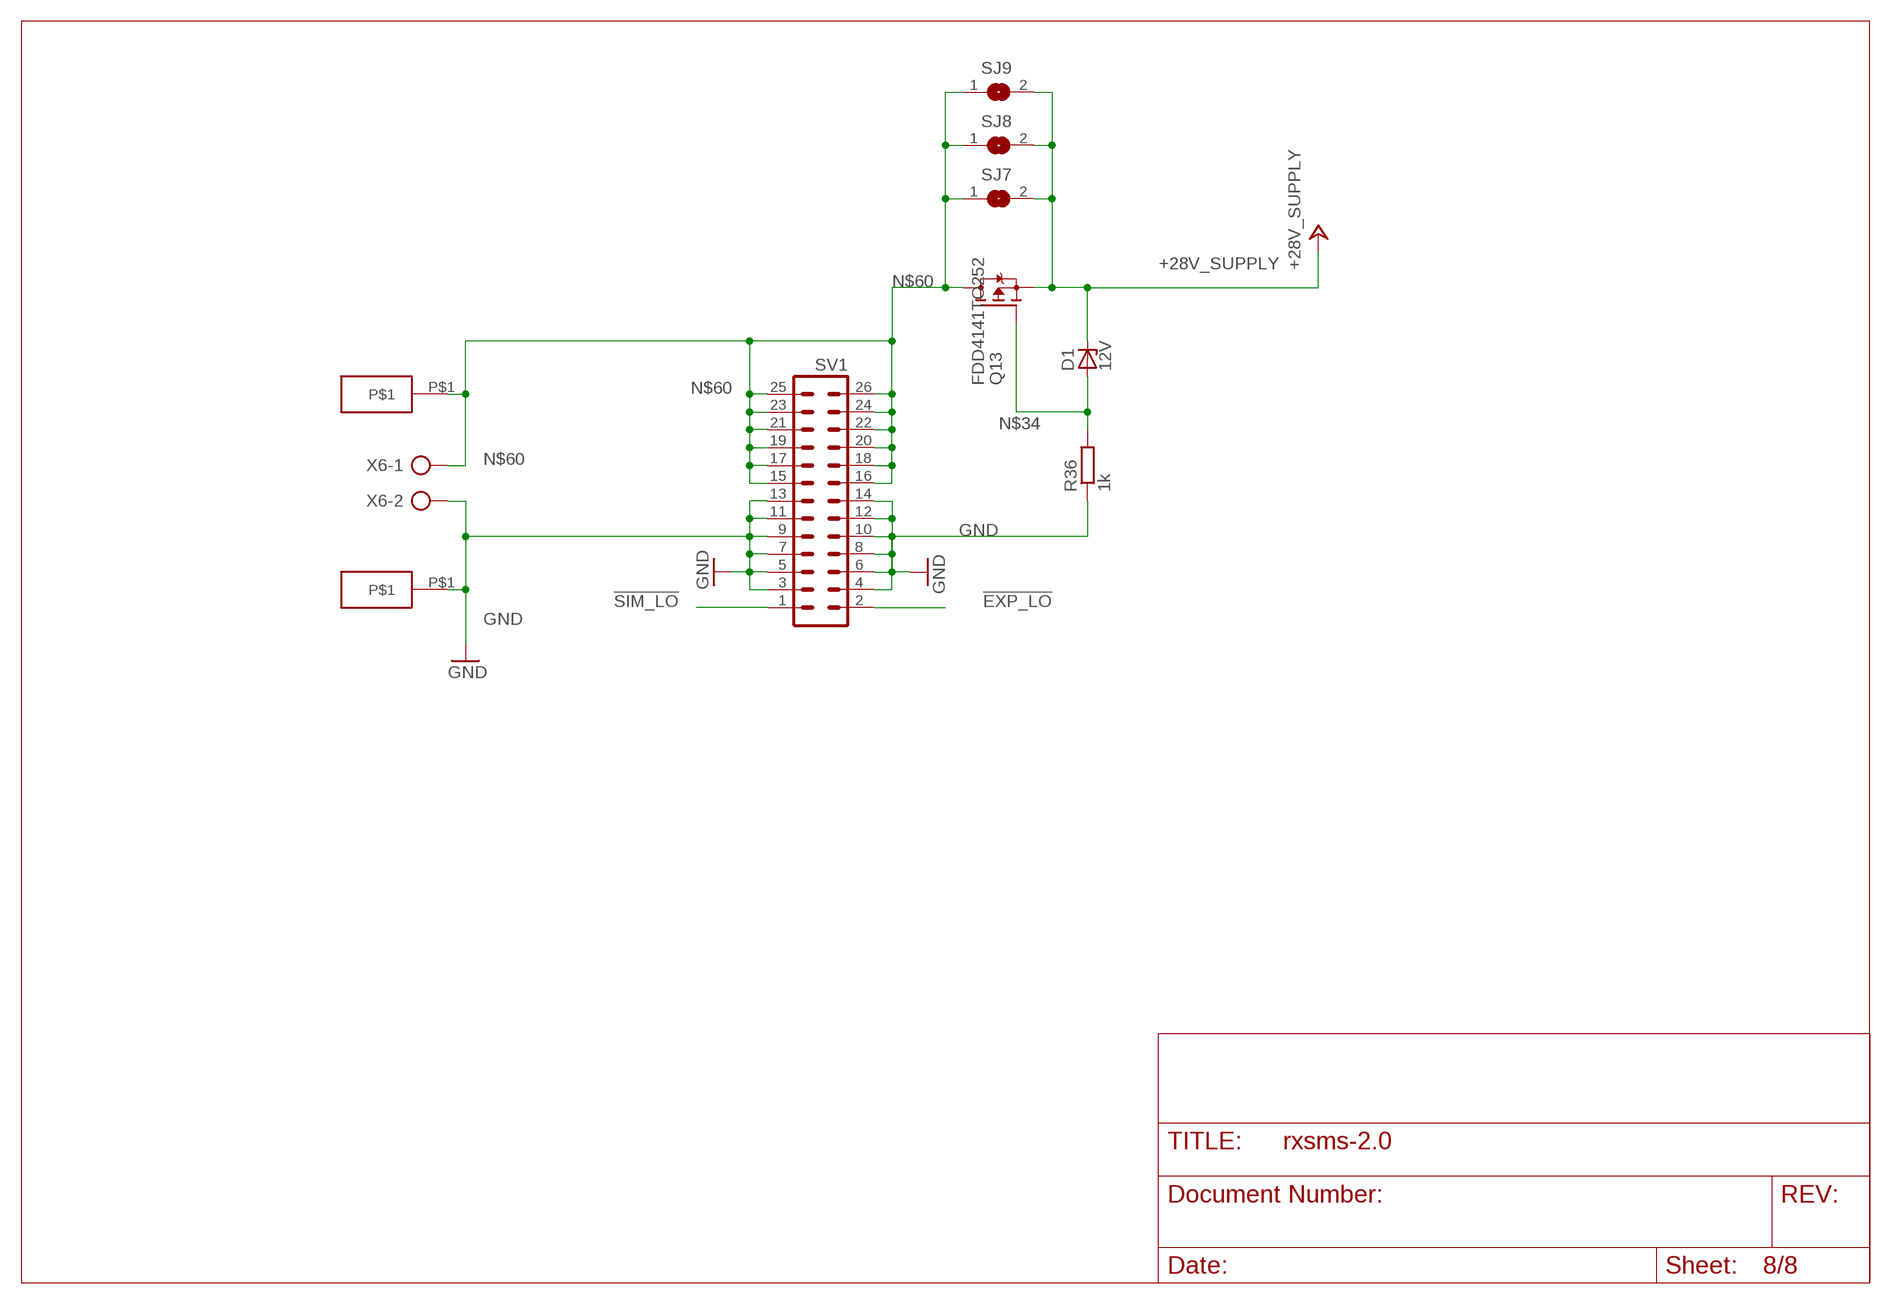
[diagram p7: schematic, sheet 8]

### Parts
D1  12V  ZENER-DIODEDO34-7  [DO34Z7]
Q13  FDD4141TO252  [TO252]
R36  1k  R-EU_R0805  [R0805]
SJ7  SJ  [SJ]
SJ8  SJ  [SJ]
SJ9  SJ  [SJ]
SV1  ML26L  [ML26L]
U$3  JACK  [JACK]
U$9  JACK  [JACK]
X6  AK500/2  [AK500/2]

### Nets
!EXP_LO: SV1.2 ; also sheet 4
!SIM_LO: SV1.1 ; also sheet 1,4
+28V_SUPPLY: D1.C Q13.2(S) SJ7.2 SJ8.2 SJ9.2 ; also sheet 2,3,4
GND: R36.1 SV1.3 SV1.4 SV1.5 SV1.6 SV1.7 SV1.8 SV1.9 SV1.10 SV1.11 SV1.12 SV1.13 SV1.14 U$3.P$1 X6.2 ; also sheet 1,2,3,4,5,6,7
N$34: D1.A Q13.1(G) R36.2
N$60: Q13.3(D) SJ7.1 SJ8.1 SJ9.1 SV1.15 SV1.16 SV1.17 SV1.18 SV1.19 SV1.20 SV1.21 SV1.22 SV1.23 SV1.24 SV1.25 SV1.26 U$9.P$1 X6.1

## Library data of the parts
C1-C5 C17-C20 = rcl:C-EU: CAPACITOR, European symbol; OC_FARNELL: 2320853
C6-C9 C16 C21-C29 C33 C36-C40 = rcl:C-EU: CAPACITOR, European symbol; OC_FARNELL: 1759265
C10 C11 = rcl:C-EU: CAPACITOR, European symbol
C12 C13 C30 C31 C35 = rcl:C-EU: CAPACITOR, European symbol; OC_FARNELL: 2346932
C14 C15 = rcl:C-EU: CAPACITOR, European symbol; OC_FARNELL: 1907510
C32 = rcl:C-EU: CAPACITOR, European symbol; OC_FARNELL: 2320856
C34 = rcl:C-EU: CAPACITOR, European symbol; OC_FARNELL: 2407305
D1 = diode:ZENER-DIODE: Z-Diode; OC_FARNELL: 1779204
JP1 JP2 = jumper:JP1E: JUMPER
L1 L2 = Coil:COIL; OC_FARNELL: 2333799
LED1_LO LED2_SOE LED3_SODS = led:LED: LED OSRAM: - CHIPLED LG R971, LG N971, LY N971, LG Q971, LY Q971, LO R971, LY R971 LH N974, LH R974 LS Q976, LO Q976, LY Q976 LO Q996 - Hyper CHIPLED LW Q18S LB Q993, LB Q99A, LB R99A - SideLED LS A670, LO A670, LY A670, LG A670, LP A670 LB A673, LV A673, LT A673, LW A673 LH A674 LY A675 LS A676, LA A676, LO A676, LY A676, LW A676 LS A679, LY A679, LG A679 - Hyper Micro SIDELED® LS Y876, LA Y876, LO Y876, LY Y876 LT Y87S - SmartLED LW L88C, LW L88S LB L89C, LB L89S, LG L890 LS L89K, LO L89K, LY L89K LS L896, LA L896, LO L896, LY L896 - TOPLED LS T670, LO T670, LY T670, LG T670, LP T670 LSG T670, LSP T670, LSY T670, LOP T670, LYG T670 LG T671, LOG T671, LSG T671 LB T673, LV T673, LT T673, LW T673 LH T674 LS T676, LA T676, LO T676, LY T676, LB T676, LH T676, LSB T676, LW T676 LB T67C, LV T67C, LT T67C, LS T67K, LO T67K, LY T67K, LW E67C LS E67B, LA E67B, LO E67B, LY E67B, LB E67C, LV E67C, LT E67C LW T67C LS T679, LY T679, LG T679 LS T770, LO T770, LY T770, LG T770, LP T770 LB T773, LV T773, LT T773, LW T773 LH T774 LS E675, LA E675, LY E675, LS T675 LS T776, LA T776, LO T776, LY T776, LB T776 LHGB T686 LT T68C, LB T68C - Hyper Mini TOPLED® LB M676 - Mini TOPLED Santana® LG M470 LS M47K, LO M47K, LY M47K Source: http://www.osram.convergy.de LUXEON: - LUMILED® LXK2-PW12-R00, LXK2-PW12-S00, LXK2-PW14-U00, LXK2-PW14-V00 LXK2-PM12-R00, LXK2-PM12-S00, LXK2-PM14-U00 LXK2-PE12-Q00, LXK2-PE12-R00, LXK2-PE12-S00, LXK2-PE14-T00, LXK2-PE14-U00 LXK2-PB12-K00, LXK2-PB12-L00, LXK2-PB12-M00, LXK2-PB14-N00, LXK2-PB14-P00, LXK2-PB14-Q00 LXK2-PR12-L00, LXK2-PR12-M00, LXK2-PR14-Q00, LXK2-PR14-R00 LXK2-PD12-Q00, LXK2-PD12-R00, LXK2-PD12-S00 LXK2-PH12-R00, LXK2-PH12-S00 LXK2-PL12-P00, LXK2-PL12-Q00, LXK2-PL12-R00 Source: www.luxeon.com KINGBRIGHT: KA-3528ASYC Source: www.kingbright.com; OC_FARNELL: 2099249
LED4_ERRINH LED5_PWR LED8 = led:LED: LED OSRAM: - CHIPLED LG R971, LG N971, LY N971, LG Q971, LY Q971, LO R971, LY R971 LH N974, LH R974 LS Q976, LO Q976, LY Q976 LO Q996 - Hyper CHIPLED LW Q18S LB Q993, LB Q99A, LB R99A - SideLED LS A670, LO A670, LY A670, LG A670, LP A670 LB A673, LV A673, LT A673, LW A673 LH A674 LY A675 LS A676, LA A676, LO A676, LY A676, LW A676 LS A679, LY A679, LG A679 - Hyper Micro SIDELED® LS Y876, LA Y876, LO Y876, LY Y876 LT Y87S - SmartLED LW L88C, LW L88S LB L89C, LB L89S, LG L890 LS L89K, LO L89K, LY L89K LS L896, LA L896, LO L896, LY L896 - TOPLED LS T670, LO T670, LY T670, LG T670, LP T670 LSG T670, LSP T670, LSY T670, LOP T670, LYG T670 LG T671, LOG T671, LSG T671 LB T673, LV T673, LT T673, LW T673 LH T674 LS T676, LA T676, LO T676, LY T676, LB T676, LH T676, LSB T676, LW T676 LB T67C, LV T67C, LT T67C, LS T67K, LO T67K, LY T67K, LW E67C LS E67B, LA E67B, LO E67B, LY E67B, LB E67C, LV E67C, LT E67C LW T67C LS T679, LY T679, LG T679 LS T770, LO T770, LY T770, LG T770, LP T770 LB T773, LV T773, LT T773, LW T773 LH T774 LS E675, LA E675, LY E675, LS T675 LS T776, LA T776, LO T776, LY T776, LB T776 LHGB T686 LT T68C, LB T68C - Hyper Mini TOPLED® LB M676 - Mini TOPLED Santana® LG M470 LS M47K, LO M47K, LY M47K Source: http://www.osram.convergy.de LUXEON: - LUMILED® LXK2-PW12-R00, LXK2-PW12-S00, LXK2-PW14-U00, LXK2-PW14-V00 LXK2-PM12-R00, LXK2-PM12-S00, LXK2-PM14-U00 LXK2-PE12-Q00, LXK2-PE12-R00, LXK2-PE12-S00, LXK2-PE14-T00, LXK2-PE14-U00 LXK2-PB12-K00, LXK2-PB12-L00, LXK2-PB12-M00, LXK2-PB14-N00, LXK2-PB14-P00, LXK2-PB14-Q00 LXK2-PR12-L00, LXK2-PR12-M00, LXK2-PR14-Q00, LXK2-PR14-R00 LXK2-PD12-Q00, LXK2-PD12-R00, LXK2-PD12-S00 LXK2-PH12-R00, LXK2-PH12-S00 LXK2-PL12-P00, LXK2-PL12-Q00, LXK2-PL12-R00 Source: www.luxeon.com KINGBRIGHT: KA-3528ASYC Source: www.kingbright.com; OC_FARNELL: 2099244
LED6 LED7 = led:LED: LED OSRAM: - CHIPLED LG R971, LG N971, LY N971, LG Q971, LY Q971, LO R971, LY R971 LH N974, LH R974 LS Q976, LO Q976, LY Q976 LO Q996 - Hyper CHIPLED LW Q18S LB Q993, LB Q99A, LB R99A - SideLED LS A670, LO A670, LY A670, LG A670, LP A670 LB A673, LV A673, LT A673, LW A673 LH A674 LY A675 LS A676, LA A676, LO A676, LY A676, LW A676 LS A679, LY A679, LG A679 - Hyper Micro SIDELED® LS Y876, LA Y876, LO Y876, LY Y876 LT Y87S - SmartLED LW L88C, LW L88S LB L89C, LB L89S, LG L890 LS L89K, LO L89K, LY L89K LS L896, LA L896, LO L896, LY L896 - TOPLED LS T670, LO T670, LY T670, LG T670, LP T670 LSG T670, LSP T670, LSY T670, LOP T670, LYG T670 LG T671, LOG T671, LSG T671 LB T673, LV T673, LT T673, LW T673 LH T674 LS T676, LA T676, LO T676, LY T676, LB T676, LH T676, LSB T676, LW T676 LB T67C, LV T67C, LT T67C, LS T67K, LO T67K, LY T67K, LW E67C LS E67B, LA E67B, LO E67B, LY E67B, LB E67C, LV E67C, LT E67C LW T67C LS T679, LY T679, LG T679 LS T770, LO T770, LY T770, LG T770, LP T770 LB T773, LV T773, LT T773, LW T773 LH T774 LS E675, LA E675, LY E675, LS T675 LS T776, LA T776, LO T776, LY T776, LB T776 LHGB T686 LT T68C, LB T68C - Hyper Mini TOPLED® LB M676 - Mini TOPLED Santana® LG M470 LS M47K, LO M47K, LY M47K Source: http://www.osram.convergy.de LUXEON: - LUMILED® LXK2-PW12-R00, LXK2-PW12-S00, LXK2-PW14-U00, LXK2-PW14-V00 LXK2-PM12-R00, LXK2-PM12-S00, LXK2-PM14-U00 LXK2-PE12-Q00, LXK2-PE12-R00, LXK2-PE12-S00, LXK2-PE14-T00, LXK2-PE14-U00 LXK2-PB12-K00, LXK2-PB12-L00, LXK2-PB12-M00, LXK2-PB14-N00, LXK2-PB14-P00, LXK2-PB14-Q00 LXK2-PR12-L00, LXK2-PR12-M00, LXK2-PR14-Q00, LXK2-PR14-R00 LXK2-PD12-Q00, LXK2-PD12-R00, LXK2-PD12-S00 LXK2-PH12-R00, LXK2-PH12-S00 LXK2-PL12-P00, LXK2-PL12-Q00, LXK2-PL12-R00 Source: www.luxeon.com KINGBRIGHT: KA-3528ASYC Source: www.kingbright.com; OC_FARNELL: 2322083
OK1-OK4 = optocoupler:HCPL0600: HEWLETT PACKARD OPTO COUPLER; MF: AGILENT TECHNOLOGIES; MPN: HCPL-0600-000E; OC_FARNELL: 9994696; OC_NEWARK: 88H7774
Q1 = crystal:CRYSTAL: CRYSTAL; OC_FARNELL: 1667008; OC_NEWARK: unknown
Q2-Q12 = transistor-small-signal:BSS123: N-CHANNEL MOS FET; OC_FARNELL: 9558640RL; OC_RS: 545-0135
Q13 = transistor-fet:FDD4141: P-Channel PowerTrench® MOSFET Source: FDD4141.pdf; OC_FARNELL: 2101406
R1-R3 R5-R11 R21 R23 R24 R26-R28 R30 R31 = rcl:R-EU_: RESISTOR, European symbol; OC_FARNELL: 1887308
R4 R37 R39 R40 = rcl:R-EU_: RESISTOR, European symbol; OC_FARNELL: 2332076
R12 R13 = rcl:R-EU_: RESISTOR, European symbol; OC_RS: 666-2386
R14 R15 = rcl:R-EU_: RESISTOR, European symbol; OC_FARNELL: 1894163
R16-R20 R43 R44 = rcl:R-EU_: RESISTOR, European symbol; OC_FARNELL: 2332071
R22 R25 = rcl:R-EU_: RESISTOR, European symbol; OC_FARNELL: 2141745
R29 R32 = rcl:R-EU_: RESISTOR, European symbol; OC_FARNELL: 2332064
R33-R35 = rcl:R-EU_: RESISTOR, European symbol; OC_FARNELL: 2309112
R36 = rcl:R-EU_: RESISTOR, European symbol
R46 R47 = rcl:R-EU_: RESISTOR, European symbol; OC_FARNELL: 2332071/2332058
R48 = rcl:R-EU_: RESISTOR, European symbol; OC_FARNELL: 2333544
R49 = rcl:R-EU_: RESISTOR, European symbol; OC_FARNELL: 2332077
R50 = rcl:R-EU_: RESISTOR, European symbol; OC_FARNELL: 1500705
SCREW1-SCREW6 = dsub-mounting-screw:DSUB_MOUNTING_SCREW; OC_FARNELL: 2135988
SJ1-SJ9 = jumper:SJ: SMD solder JUMPER
SV1 = con-harting-ml:ML26: HARTING; OC_FARNELL: 1096983; OC_NEWARK: unknown
SV2-SV6 = con-harting-ml:ML6: HARTING; OC_FARNELL: 1096984; OC_NEWARK: unknown; OC_RS: 740-7105
T1_LO T2_SOE T4_PWR T5_ERRINH T9_SODS = SMSIp67:SMS_IP67: Großer Tastschalter Taster Switch Schalter; OC_FARNELL: 1217758
T3_SOE T8_LO T10_SODS = mentor-switch:SWITCH_LED; OC_BUERKLIN: 12 G 203
T6_PWR T7_ERRINH = mentor-switch:SWITCH_LED; OC_BUERKLIN: 12 G 205
U1 = maxim:MAX3232*: True RS-232 Transceivers 3.0V to 5.5V, Low-Power up to 1Mbps, Using Four 0.1µF External Capacitors Source: http://pdfserv.maxim-ic.com/en/ds/MAX3222-MAX3241.pdf; MF: MAXIM; MPN: MAX3232ESE; OC_FARNELL: 9725539; OC_NEWARK: 79C3880
U2 = avr-7:XMEGA-A4U: Atmel XMega A4U series processor; OC_FARNELL: 2066309
U3 = _traco_tsr-1:TSR_1-*: TRACO TSR-1 Series Point-of-Load DC/DC-Converters Vi max. 36 V; Vo = (1.2 .. 15)V ±2%; Io = 0 .. 1 A SIP-Package (drop-in replacement for 78xx linear voltage regulators in TO220-package, vertically assembled) Source: www.tracopower.com Technologies: TSR 1- Vi (V) Vo (V) ±2% Io = 0 .. 1 A 24_ ( generic ) 2412 4.6 .. 36 1.2 2415 4.6 .. 36 1.5 2418 4.6 .. 36 1.8 2425 4.6 .. 36 2.5 2433 4.75.. 36 3.3 2450 6.5 .. 36 5.0 2465 9.0 .. 36 6.5 2490 12 .. 36 9.0 24120 15 .. 36 12 24150 18 .. 36 15 Author: Dipl.-Ing. FH Rainer Bayer HHN Hochschule Heilbronn, rainer.bayer@hs-heilbronn.de Ingenieurbüro ing-rb, mail@ing-rb.de; OC_FARNELL: 1696320
U4 = LM1117:LM1117; OC_FARNELL: 1685603
U5 = NC7WZ17:NC7WZ17P6X: Dual Buffer; MPN: NC7WZ17P6X; OC_FARNELL: 1651986; OC_NEWARK: 38C7625; PACKAGE: SC-70-6; SUPPLIER: FAIRCHILD SEMICONDUCTOR
U6 = adum3160:ADUM3160; OC_FARNELL: 1843660
U7 = TPS731xx:TPS731*; OC_FARNELL: 2112625
U8 = nup2202w1:NUP2202W1; OC_RS: 463-690
U$3 U$9 = jack:JACK; OC_FARNELL: 1854507 (black), 1854508 (red), 1854511 (blue), 1854510 (yellow)
U$4 = UDN2596:UDN2596; OC_FARNELL: 1103848
U$5 = SP491:SP490; OC_FARNELL: 9387234
U$6 = BTS6134:BTS6143; OC_FARNELL: 1440813
U$7_BER U$8_DROPR U$9_DROPDUR = poti:STRK11K: Potentiometer; OC_FARNELL: 1345093
U$10 = TEN3:TEN3-2410N; OC_RS: 801-9330
X1 = con-berg:PN61729-S: BERG USB connector; OC_FARNELL: 1642035; OC_NEWARK: unknown; OC_RS: 515-1989
X2_GROUNDSTATION X3_DEBUG = con-subd:F09HP: SUB-D; OC_FARNELL: 1207597; OC_NEWARK: unknown
X4 = con-subd:F15HP: SUB-D; OC_FARNELL: 1207598; OC_NEWARK: unknown
X5 = light-pipe:RLP2-200-500; OC_RS: 752-9157
X6 = con-ptr500:AK500/2: CONNECTOR; OC_FARNELL: 1131855; OC_NEWARK: unknown